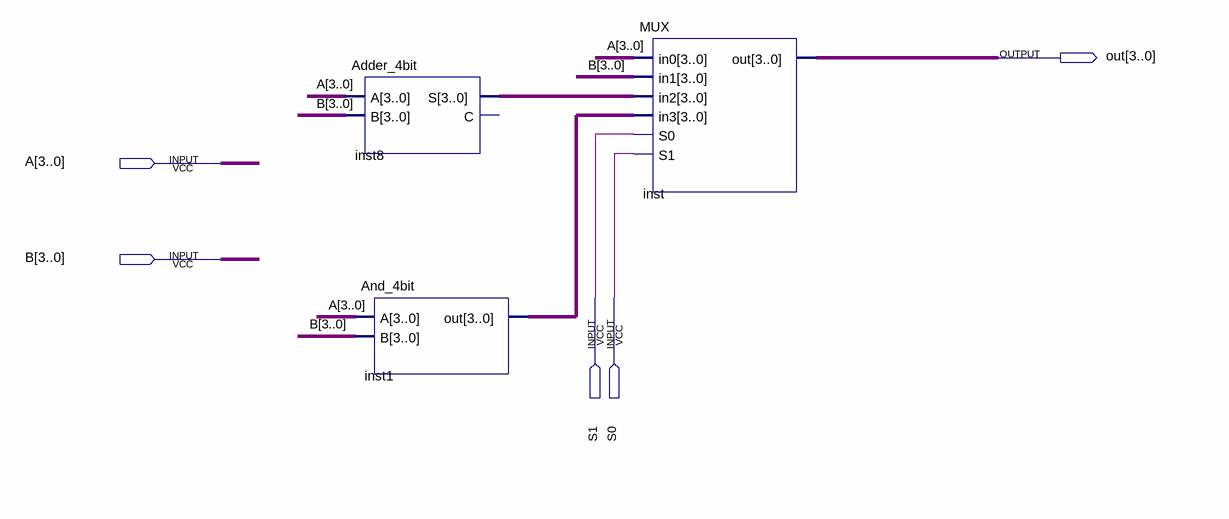
[diagram p0: schematic sheet]
// Quartus schematic ALU.bdf as structural Verilog: 3 symbols, 5 pins
module ALU (
  input  [3:0] A,
  input  [3:0] B,
  input  S1,
  input  S0,
  output [3:0] out
);

  wire [3:0] inst1_out, inst8_s;

  Adder_4bit inst8 (.A(A), .B(B), .S(inst8_s));  // open: C
  And_4bit inst1 (.A(A), .B(B), .out(inst1_out));
  MUX inst (.in0(A), .in1(B), .in2(inst8_s), .in3(inst1_out), .S0(S1), .S1(S0), .out(out));
endmodule
